# EAGLE schematic RightSideIoConnectors (EAGLE 9.5.2)
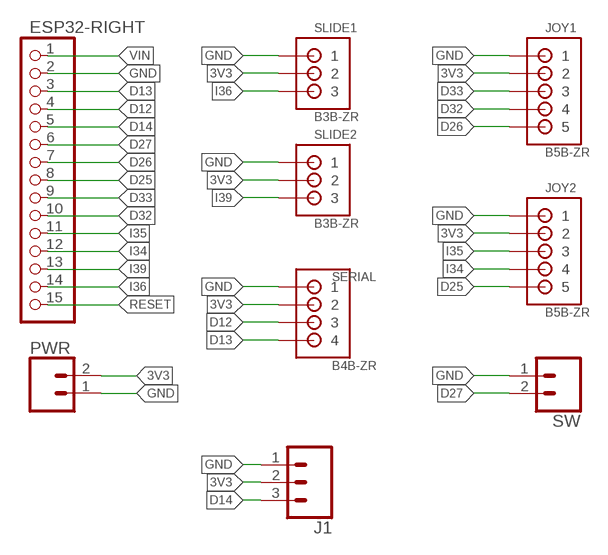
[diagram p0: schematic, sheet 1]

## Parts
ESP32-RIGHT  0  PINHD-1X15  [1X15]
J1  CONN_03  [1X03]
JOY1  B5B-ZR  [B5B-ZR]
JOY2  B5B-ZR  [B5B-ZR]
PWR  CONN_02  [1X02]
SERIAL  B4B-ZR  [B4B-ZR]
SLIDE1  B3B-ZR  [B3B-ZR]
SLIDE2  B3B-ZR  [B3B-ZR]
SW  CONN_02  [1X02]

## Nets
3V3: J1.2 JOY1.2 JOY2.2 PWR.2 SERIAL.2 SLIDE1.2 SLIDE2.2
D12: ESP32-RIGHT.4 SERIAL.3
D13: ESP32-RIGHT.3 SERIAL.4
D14: ESP32-RIGHT.5 J1.3
D25: ESP32-RIGHT.8 JOY2.5
D26: ESP32-RIGHT.7 JOY1.5
D27: ESP32-RIGHT.6 SW.2
D32: ESP32-RIGHT.10 JOY1.4
D33: ESP32-RIGHT.9 JOY1.3
GND: ESP32-RIGHT.2 J1.1 JOY1.1 JOY2.1 PWR.1 SERIAL.1 SLIDE1.1 SLIDE2.1 SW.1
I34: ESP32-RIGHT.12 JOY2.4
I35: ESP32-RIGHT.11 JOY2.3
I36: ESP32-RIGHT.14 SLIDE1.3
I39: ESP32-RIGHT.13 SLIDE2.3
RESET: ESP32-RIGHT.15
VIN: ESP32-RIGHT.1

## Library data of the parts
ESP32-RIGHT = pinhead:PINHD-1X15: PIN HEADER
J1 = SparkFun-Connectors:CONN_03: Multi connection point. Often used as Generic Header-pin footprint for 0.1 inch spaced/style header connections On any of the 0.1 inch spaced packages, you can populate with these: Break Away Headers - Straight <https://www.sparkfun.com/products/116> (PRT-00116) Break Away Male Headers - Right Angle <https://www.sparkfun.com/products/553> (PRT-00553) Female Headers <https://www.sparkfun.com/products/115> (PRT-00115) Break Away Headers - Machine Pin <https://www.sparkfun.com/products/117> (PRT-00117) Break Away Female Headers - Swiss Machine Pin <https://www.sparkfun.com/products/743> (PRT-00743) Stackable Header - 3 Pin (Female, 0.1") <https://www.sparkfun.com/products/13875> (PRT-13875) For SCREWTERMINALS and SPRING TERMINALS visit here: Screw Terimnals on SparkFun.com <https://www.sparkfun.com/search/results?term=Screw+Terminals> (5mm/3.5mm/2.54mm spacing) This device is also useful as a general connection point to wire up your design to another part of your project. Our various solder wires solder well into these plated through hole pads. Hook-Up Wire - Assortment (Stranded, 22 AWG) <https://www.sparkfun.com/products/11375> (PRT-11375) Hook-Up Wire - Assortment (Solid Core, 22 AWG) <https://www.sparkfun.com/products/11367> (PRT-11367) View the entire wire category on our website here <https://www.sparkfun.com/categories/141> Special notes: Molex polarized connector foot print use with SKU : PRT-08232 with associated crimp pins and housings.
JOY1 JOY2 = jst:B5B-ZR: JST-ZH Connector 5 pol, 1.5mm pitch Package: B5B-ZR Source: http://www.jst-mfg.com/product/pdf/eng/eZH.pdf
PWR SW = SparkFun-Connectors:CONN_02: Multi connection point. Often used as Generic Header-pin footprint for 0.1 inch spaced/style header connections On any of the 0.1 inch spaced packages, you can populate with these: Break Away Headers - Straight <https://www.sparkfun.com/products/116> (PRT-00116) Break Away Male Headers - Right Angle <https://www.sparkfun.com/products/553> (PRT-00553) Female Headers <https://www.sparkfun.com/products/115> (PRT-00115) Break Away Headers - Machine Pin <https://www.sparkfun.com/products/117> (PRT-00117) Break Away Female Headers - Swiss Machine Pin <https://www.sparkfun.com/products/743> (PRT-00743) For SCREWTERMINALS and SPRING TERMINALS visit here: Screw Terimnals on SparkFun.com <https://www.sparkfun.com/search/results?term=Screw+Terminals> (5mm/3.5mm/2.54mm spacing) This device is also useful as a general connection point to wire up your design to another part of your project. Our various solder wires solder well into these plated through hole pads. Hook-Up Wire - Assortment (Stranded, 22 AWG) <https://www.sparkfun.com/products/11375> (PRT-11375) Hook-Up Wire - Assortment (Solid Core, 22 AWG) <https://www.sparkfun.com/products/11367> (PRT-11367) View the entire wire category on our website here <https://www.sparkfun.com/categories/141> Special notes: Molex polarized connector foot print use with: PRT-08233 with associated crimp pins and housings. 2.54_SCREWTERM for use with PRT-10571. 3.5mm Screw Terminal footprints for PRT-08084 5mm Screw Terminal footprints for use with PRT-08432
SERIAL = jst:B4B-ZR: JST-ZH Connector 4 pol, 1.5mm pitch Package: B4B-ZR Source: http://www.jst-mfg.com/product/pdf/eng/eZH.pdf
SLIDE1 SLIDE2 = jst:B3B-ZR: JST-ZH Connector 3 pol, 1.5mm pitch Package: B3B-ZR Source: http://www.jst-mfg.com/product/pdf/eng/eZH.pdf